# EAGLE schematic test_instrumentation_amplifier (EAGLE 9.0.1)
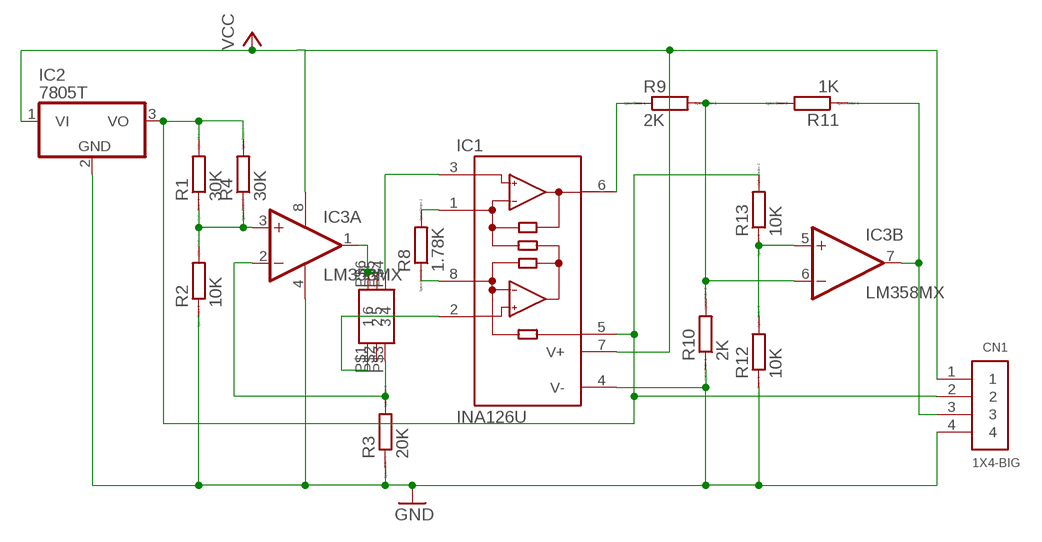
[diagram p0: schematic, sheet 1]

## Parts
CN1  1X4-BIG  [1X04-BIG]
IC1  INA126U  [SO08]
IC2  7805T  [TO220H]
IC3  LM358MX  [SO08]
R1  30K  R0207/10  [0207/10]
R2  10K  R0207/10  [0207/10]
R3  20K  R0207/10  [0207/10]
R4  30K  R0207/10  [0207/10]
R8  1.78K  R0207/10  [0207/10]
R9  2K  R0207/10  [0207/10]
R10  2K  R0207/10  [0207/10]
R11  1K  R0207/10  [0207/10]
R12  10K  R0207/10  [0207/10]
R13  10K  R0207/10  [0207/10]
U$1  2SMPP-03  [2SMPP-03]

## Nets
GND: CN1.4 IC1.4(V-) IC2.2(GND) IC3.4(P:V-) R2.1 R3.1 R10.1 R12.1
N$1: IC3.6(B:-IN) R9.2 R10.2 R11.2
N$2: IC1.8(RG) R8.1
N$3: IC1.3(+IN) U$1.P$4
N$4: CN1.2 IC1.5(REF) IC2.3(VO) R1.2 R4.2 R13.2
N$5: IC1.1(RG) R8.2
N$7: IC1.2(-IN) U$1.P$1
N$8: IC3.1(A:OUT) U$1.P$5 U$1.P$6
N$9: IC1.6(OUT) R9.1
N$10: IC3.3(A:+IN) R1.1 R2.2 R4.1
N$11: IC3.5(B:+IN) R12.2 R13.1
N$12: CN1.3 IC3.7(B:OUT) R11.1
N$13: IC3.2(A:-IN) R3.2 U$1.P$3
VCC: CN1.1 IC1.7(V+) IC2.1(VI) IC3.8(P:V+)
Unconnected: U$1.P$2

## Library data of the parts
CN1 = adafruit:1X4: 4-pin connector
IC1 = INA126:INA126: Instrumentation Amplifier Micropower, Single and Dual Versions; AVAILABILITY: Unavailable; DESCRIPTION: the ina126 and ina2126 are precision instrumentation amplifiers for accurate low noise differential signal acquisitio...; MF: Texas Instruments; MP: INA126; PACKAGE: TSSOP-8 Texas Instruments; PRICE: None
IC2 = linear:78*: Positive VOLTAGE REGULATOR Source: http://cache.national.com/ds/LM/LM78L05.pdf http://www.fairchildsemi.com/ds/LM/LM7805.pdf; SPICEPREFIX: X
IC3 = linear:LM358: OP AMP also LM158; LM258; LM2904 Source: http://cache.national.com/ds/LM/LM158.pdf
R1-R4 R8-R13 = eagle-ltspice:R: RESISTOR, European symbol; SPICEMODEL: NONE; SPICEPREFIX: R
U$1 = programmable-air-components:2SMPP-03